# Altium schematic sheet Dev.SchDoc
size 292 x 193 mm; Author: Power Lin; DocumentNumber: 3; SheetNumber: 3; SheetTotal: 4; Website: wiki-power.com
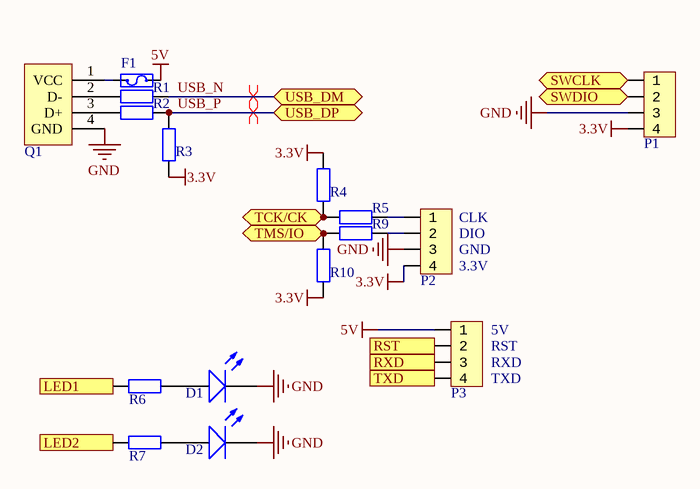
[diagram p0: Dev.SchDoc]

## Parts
D1  RED  [LED-0603]  (value not drawn)
D2  GREEN  [LED-0603]  (value not drawn)
F1  Fuse  [Fuse_0805]  (value not drawn)
P1  HDR1x4_2.54  [HDR1x4_2.54_180]  (value not drawn)
P2  HDR1x4_2.54  [HDR1X4_2.54_180H]  (value not drawn)
P3  HDR1x4_2.54  [HDR1X4_2.54_180H]  (value not drawn)
Q1  USB A  [USB_A(M)_DIP]  (value not drawn)
R1  22R  [R-0603]  (value not drawn)
R2  22R  [R-0603]  (value not drawn)
R3  1.5K  [R-0603]  (value not drawn)
R4  1R  [R-0603]  (value not drawn)
R5  22R  [R-0603]  (value not drawn)
R6  10K  [R-0603]  (value not drawn)
R7  10K  [R-0603]  (value not drawn)
R9  22R  [R-0603]  (value not drawn)
R10  1R  [R-0603]  (value not drawn)

## Ports
LED1 (in), LED2 (in), RST (in), RXD (out), SWCLK (bidir), SWDIO (bidir), TCK/CK (bidir), TMS/IO (bidir), TXD (in), USB_DM (bidir), USB_DP (bidir)

## Nets
3.3V: P1.4 P2.4 R3.1 R4.2 R10.1
5V: F1.2 P3.1
GND: D1.K D2.K P1.3 P2.3 Q1.4(GND)
LED1: R6.2 ; port LED1
LED2: R7.2 ; port LED2
RST: P3.2 ; port RST
RXD: P3.3 ; port RXD
SWCLK: P1.1 ; port SWCLK
SWDIO: P1.2 ; port SWDIO
TCK/CK: R4.1 R5.1 ; port TCK/CK
TMS/IO: R9.1 R10.2 ; port TMS/IO
TXD: P3.4 ; port TXD
USB_N: R1.2 ; port USB_DM
USB_P: R2.2 R3.2 ; port USB_DP
NetD1_A: D1.A R6.1
NetD2_A: D2.A R7.1
NetF1_1: F1.1 Q1.1(VCC)
NetP2_1: P2.1 R5.2
NetP2_2: P2.2 R9.2
NetQ1_2: Q1.2(D-) R1.1
NetQ1_3: Q1.3(D+) R2.1

## Layout directives
differential pair: USB_N, USB_P

## Notes on the sheet
- (near P2) CLK
- (near P2) DIO
- (near P2) GND
- 3.3V
- (near P3) RXD
- (near P3) RST
- (near P3) 5V
- (near P3) TXD
- Author
- DocumentName
- ModifiedDate
- ProjectName
- SheetNumber
- SheetTotal
- Website
- Revision

## Library data of the parts
D1 D2 = LED: 发光二极管; pin to pad: A>1 K>2; ComponentLink1Description: 供应商链接; ComponentLink1URL: http://www.szlcsc.com/product/details_2663.html; Package: 0603; Supplier: LC; SuppliersPartNumber: C2290
F1 = Fuse: 6V 500mA 保险丝
P1-P3 = HDR1x4_2.54: Header
Q1 = USB A: USB 接口
R1-R7 R9 R10 = RES: 贴片电阻; Package: 0805; Supplier: LC; SuppliersPartNumber: C17798